# EAGLE design M162B (EAGLE 6.6.0)
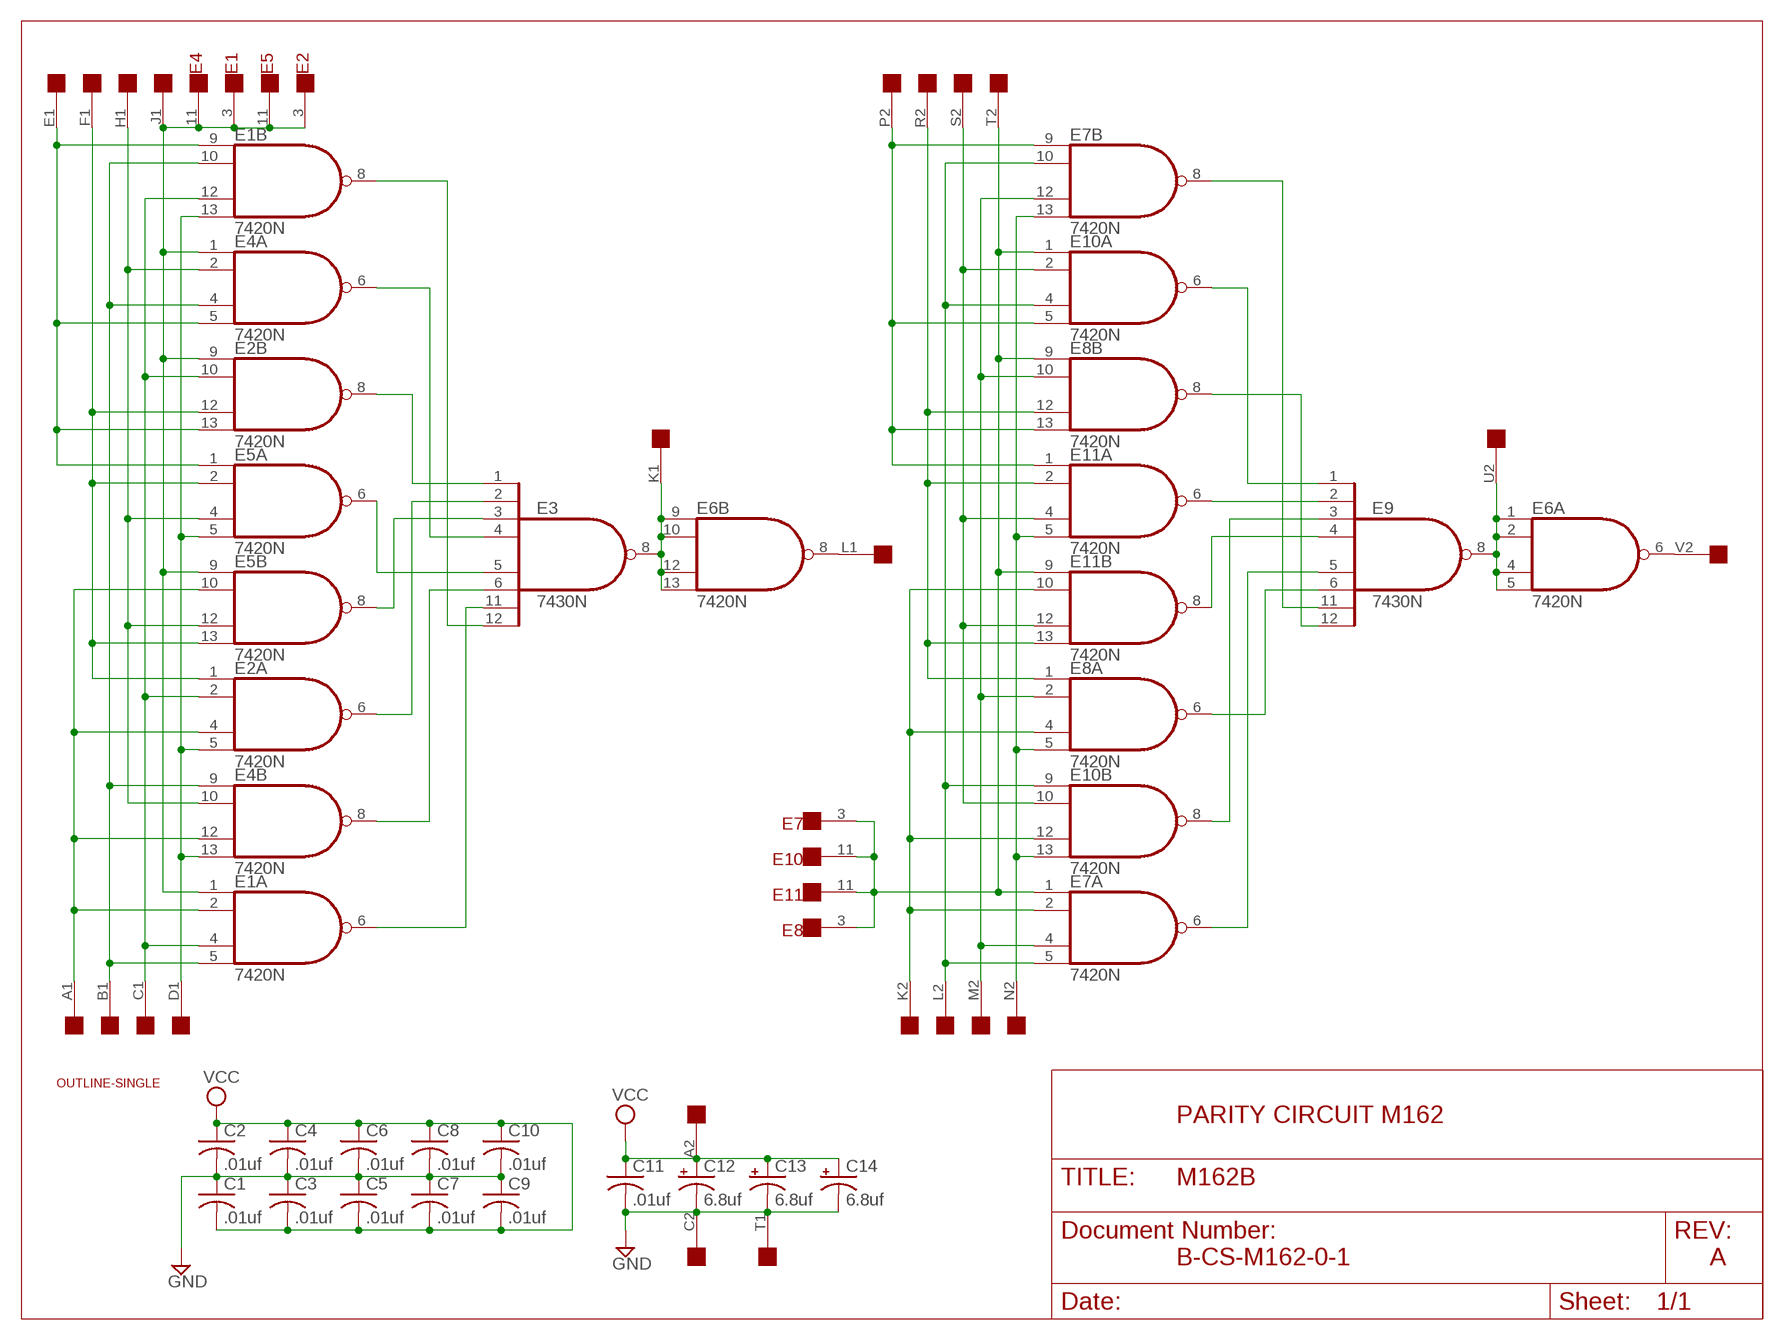
[diagram p0: schematic, sheet 1]

## Parts
C1  .01uf  C-US050-025X075  [C050-025X075]
C2  .01uf  C-US050-025X075  [C050-025X075]
C3  .01uf  C-US050-025X075  [C050-025X075]
C4  .01uf  C-US050-025X075  [C050-025X075]
C5  .01uf  C-US050-025X075  [C050-025X075]
C6  .01uf  C-US050-025X075  [C050-025X075]
C7  .01uf  C-US050-025X075  [C050-025X075]
C8  .01uf  C-US050-025X075  [C050-025X075]
C9  .01uf  C-US050-025X075  [C050-025X075]
C10  .01uf  C-US050-025X075  [C050-025X075]
C11  .01uf  C-US050-025X075  [C050-025X075]
C12  6.8uf  CPOL-USE15-5AXIAL  [E15-5]
C13  6.8uf  CPOL-USE15-5AXIAL  [E15-5]
C14  6.8uf  CPOL-USE15-5AXIAL  [E15-5]
E1  7420N  74S20N  [DIL14]
E2  7420N  74S20N  [DIL14]
E3  7430N  [DIL14]
E4  7420N  74S20N  [DIL14]
E5  7420N  74S20N  [DIL14]
E6  7420N  74S20N  [DIL14]
E7  7420N  74S20N  [DIL14]
E8  7420N  74S20N  [DIL14]
E9  7430N  [DIL14]
E10  7420N  74S20N  [DIL14]
E11  7420N  74S20N  [DIL14]
U$1  OUTLINE-SINGLE  [SINGLE]
U$2  EDGE-2CONNECTOR  [EDGE-CON2]

## Nets
GND [Supply]: C1.1 C2.2 C3.1 C4.2 C5.1 C6.2 C7.1 C8.2 C9.1 C10.2 C11.2 C12.- C13.- C14.- U$2.C2 U$2.T1
N$1: E1.2(A:I1) E2.4(A:I2) E4.12(B:I2) E5.10(B:I1) U$2.A1
N$2: E1.13(B:I3) E2.5(A:I3) E4.13(B:I3) E5.5(A:I3) U$2.D1
N$3: E1.1(A:I0) E1.3(3:NC) E2.3(3:NC) E2.9(B:I0) E4.1(A:I0) E4.11(11:NC) E5.9(B:I0) E5.11(11:NC) U$2.J1
N$4: E4.2(A:I1) E4.10(B:I1) E5.4(A:I2) E5.12(B:I2) U$2.H1
N$5: E1.4(A:I2) E1.12(B:I2) E2.2(A:I1) E2.10(B:I1) U$2.C1
N$6: E1.5(A:I3) E1.10(B:I1) E4.4(A:I2) E4.9(B:I0) U$2.B1
N$7: E2.1(A:I0) E2.12(B:I2) E5.2(A:I1) E5.13(B:I3) U$2.F1
N$8: E1.9(B:I0) E2.13(B:I3) E4.5(A:I3) E5.1(A:I0) U$2.E1
N$9: E1.8(B:O) E3.12(I7)
N$10: E3.4(I3) E4.6(A:O)
N$11: E2.8(B:O) E3.1(I0)
N$12: E3.5(I4) E5.6(A:O)
N$13: E3.3(I2) E5.8(B:O)
N$14: E2.6(A:O) E3.2(I1)
N$15: E1.6(A:O) E3.11(I6)
N$16: E3.6(I5) E4.8(B:O)
N$17: E3.8(O) E6.9(B:I0) E6.10(B:I1) E6.12(B:I2) E6.13(B:I3) U$2.K1
N$18: E7.2(A:I1) E8.4(A:I2) E10.12(B:I2) E11.10(B:I1) U$2.K2
N$19: E7.13(B:I3) E8.5(A:I3) E10.13(B:I3) E11.5(A:I3) U$2.N2
N$20: E7.1(A:I0) E7.3(3:NC) E8.3(3:NC) E8.9(B:I0) E10.1(A:I0) E10.11(11:NC) E11.9(B:I0) E11.11(11:NC) U$2.T2
N$21: E10.2(A:I1) E10.10(B:I1) E11.4(A:I2) E11.12(B:I2) U$2.S2
N$22: E7.4(A:I2) E7.12(B:I2) E8.2(A:I1) E8.10(B:I1) U$2.M2
N$23: E7.5(A:I3) E7.10(B:I1) E10.4(A:I2) E10.9(B:I0) U$2.L2
N$24: E8.1(A:I0) E8.12(B:I2) E11.2(A:I1) E11.13(B:I3) U$2.R2
N$25: E7.9(B:I0) E8.13(B:I3) E10.5(A:I3) E11.1(A:I0) U$2.P2
N$26: E7.8(B:O) E9.11(I6)
N$27: E9.1(I0) E10.6(A:O)
N$28: E8.8(B:O) E9.12(I7)
N$29: E9.2(I1) E11.6(A:O)
N$30: E9.4(I3) E11.8(B:O)
N$31: E8.6(A:O) E9.6(I5)
N$32: E7.6(A:O) E9.5(I4)
N$33: E9.3(I2) E10.8(B:O)
N$34: E6.1(A:I0) E6.2(A:I1) E6.4(A:I2) E6.5(A:I3) E9.8(O) U$2.U2
N$35: E6.6(A:O) U$2.V2
N$36: E6.8(B:O) U$2.L1
VCC [Supply]: C1.2 C2.1 C3.2 C4.1 C5.2 C6.1 C7.2 C8.1 C9.2 C10.1 C11.1 C12.+ C13.+ C14.+ U$2.A2
Unconnected: E1.11(11:NC) E2.11(11:NC) E4.3(3:NC) E5.3(3:NC) E6.3(3:NC) E6.11(11:NC) E7.11(11:NC) E8.11(11:NC) E10.3(3:NC) E11.3(3:NC) U$2.B2 U$2.D2 U$2.E2 U$2.F2 U$2.H2 U$2.J2 U$2.M1 U$2.N1 U$2.P1 U$2.R1 U$2.S1 U$2.U1 U$2.V1

## Notes on the sheet
- PARITY CIRCUIT M162
- B-CS-M162-0-1 | A

## Power pins joined to a net without a drawn wire
GND: E1.7(P:GND) E2.7(P:GND) E3.7(GND) E4.7(P:GND) E5.7(P:GND) E6.7(P:GND) E7.7(P:GND) E8.7(P:GND) E9.7(GND) E10.7(P:GND) E11.7(P:GND)
VCC: E1.14(P:VCC) E2.14(P:VCC) E3.14(VCC) E4.14(P:VCC) E5.14(P:VCC) E6.14(P:VCC) E7.14(P:VCC) E8.14(P:VCC) E9.14(VCC) E10.14(P:VCC) E11.14(P:VCC)

## Library data of the parts
C1-C11 = rcl:C-US: CAPACITOR, American symbol
C12-C14 = rcl:CPOL-US: POLARIZED CAPACITOR, American symbol
E1 E2 E4-E8 E10 E11 = dec-con:74*20: Dual 4-input NAND gate
E3 E9 = 74xx-us:74*30: 8-input NAND gate
U$1 = dec-con:OUTLINE-*: Board outlines for DEC boards.
U$2 = dec-con:EDGE-2: Double-Sided DEC edge connector.

## Net classes
1 Supply: width 0.813 mm

## Board
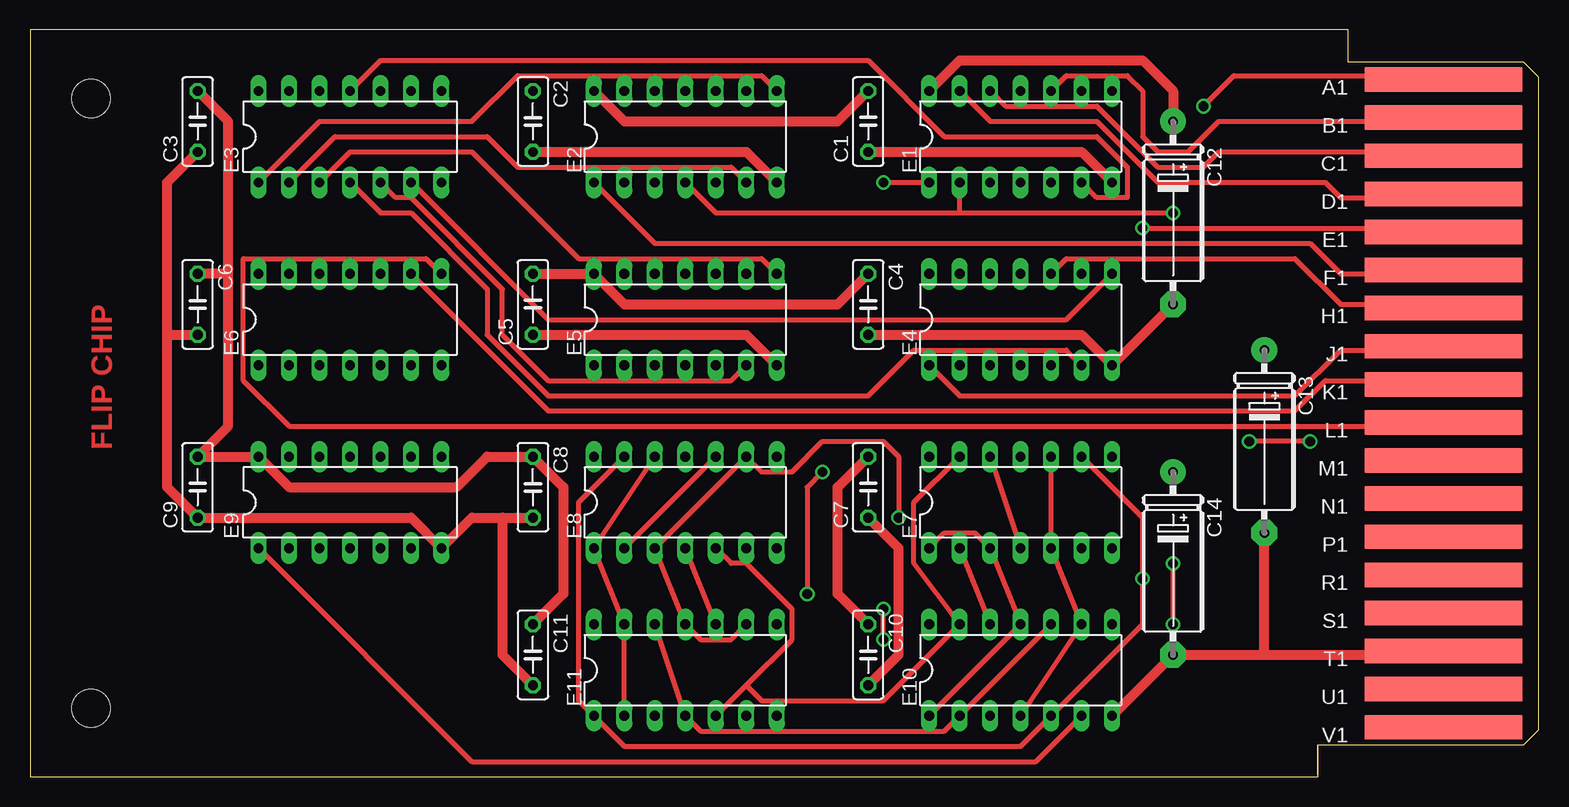
[diagram p1: board, top side]
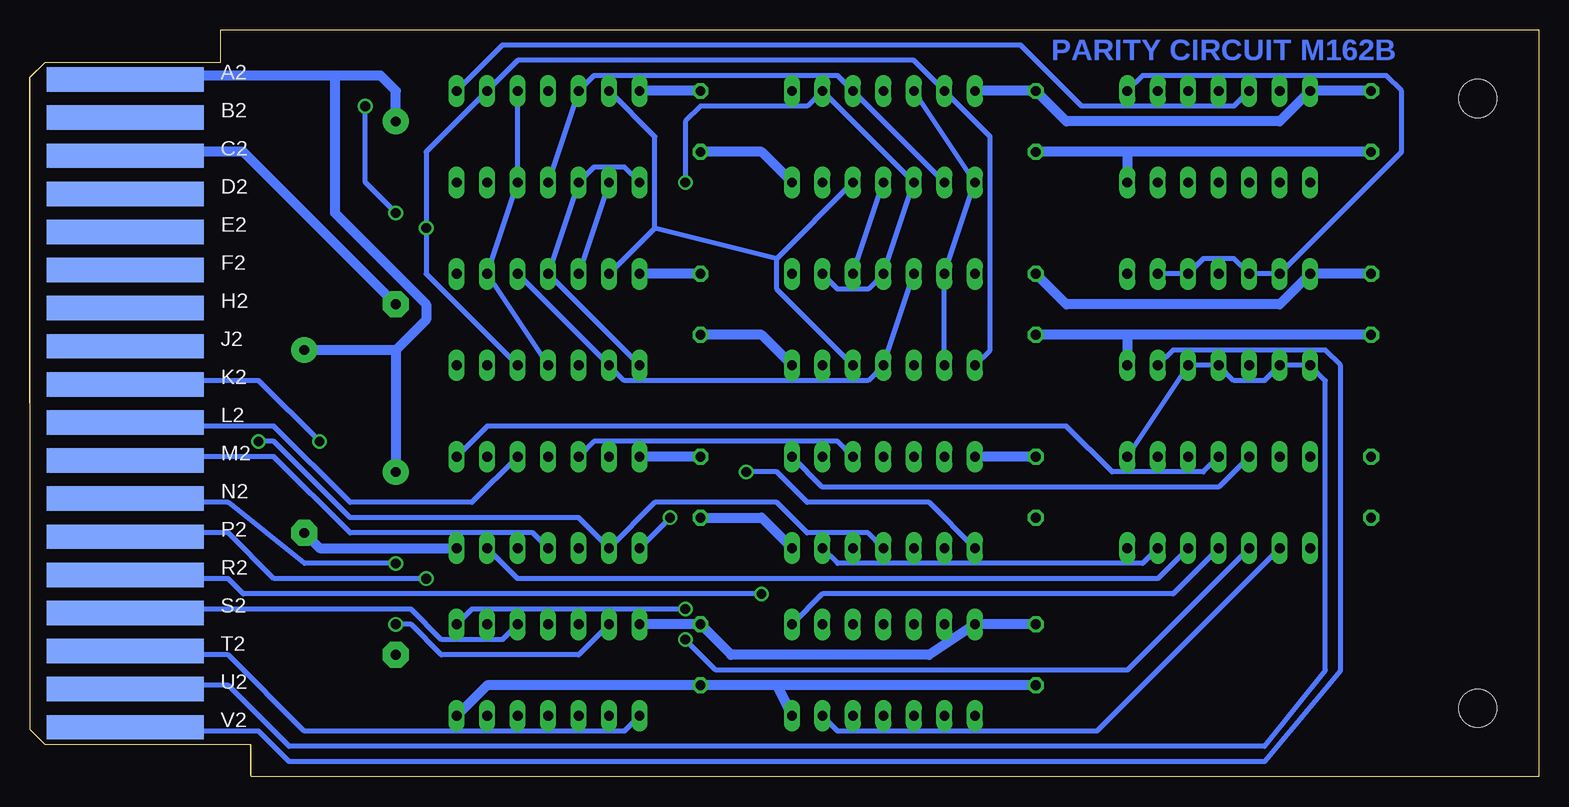
[diagram p2: board, bottom side, seen from below]

Size 125.73 x 62.23 mm. Coordinates in mm from the lower left corner, seen from the top.
Copper layers (1*16): Top 0.035mm / dielectric 1.5mm / Bottom 0.035mm
Design rules "16mils": minimum track width 16mil, minimum drill 32mil, track to track 15mil, track to pad 10mil, pad to pad 10mil, via to via 10mil, smd to smd 10mil, copper to edge 25mil, drill to drill 10mil, minimum pad ring 10mil, minimum via ring 8mil, stop-mask expansion 0mil, vias tented up to drill 0mil, thermal gap 10mil

### Footprints (pad centres in the part's own frame; a part is rotated, then mirrored left to right if it is on the bottom)
C050-025X075 = drill 0.813 octagon: 1 -2.54,0; 2 2.54,0
E15-5 = drill 0.813 pad 2.159: + -7.62,0 | drill 0.813 pad 2.159 octagon: - 7.62,0
DIL14 = drill 0.813 long: 1 -7.62,-3.81; 2 -5.08,-3.81; 3 -2.54,-3.81; 4 0,-3.81; 5 2.54,-3.81; 6 5.08,-3.81; 7 7.62,-3.81; 8 7.62,3.81; 9 5.08,3.81; 10 2.54,3.81; 11 0,3.81; 12 -2.54,3.81; 13 -5.08,3.81; 14 -7.62,3.81
SINGLE = hole 3.175: 120.65,56.515; 120.65,5.715
EDGE-CON2 = smd 13.106 x 2.032: A1 7.938,4.128; B1 7.938,7.303; C1 7.938,10.477; D1 7.938,13.652; E1 7.938,16.828; F1 7.938,20.003; H1 7.938,23.177; J1 7.938,26.352; K1 7.938,29.527; L1 7.938,32.703; M1 7.938,35.877; N1 7.938,39.053; P1 7.938,42.227; R1 7.938,45.403; S1 7.938,48.578; T1 7.938,51.752; U1 7.938,54.928; V1 7.938,58.102 | smd 13.106 x 2.032 bottom: A2 7.938,4.128; B2 7.938,7.303; C2 7.938,10.477; D2 7.938,13.652; E2 7.938,16.828; F2 7.938,20.003; H2 7.938,23.177; J2 7.938,26.352; K2 7.938,29.527; L2 7.938,32.703; M2 7.938,35.877; N2 7.938,39.053; P2 7.938,42.227; R2 7.938,45.403; S2 7.938,48.578; T2 7.938,51.752; U2 7.938,54.928; V2 7.938,58.102

### Placement (x,y rotation side)
C1  69.85,54.61 90 top
C2  41.91,54.61 270 top
C3  13.97,54.61 90 top
C4  69.85,39.37 270 top
C5  41.91,39.37 90 top
C6  13.97,39.37 270 top
C7  69.85,24.13 90 top
C8  41.91,24.13 270 top
C9  13.97,24.13 90 top
C10  69.85,10.16 270 top
C11  41.91,10.16 270 top
C12  95.25,46.99 270 top
C13  102.87,27.94 270 top
C14  95.25,17.78 270 top
E1  82.55,53.34 0 top
E2  54.61,53.34 0 top
E3  26.67,53.34 0 top
E4  82.55,38.1 0 top
E5  54.61,38.1 0 top
E6  26.67,38.1 0 top
E7  82.55,22.86 0 top
E8  54.61,22.86 0 top
E9  26.67,22.86 0 top
E10  82.55,8.89 0 top
E11  54.61,8.89 0 top
U$1  125.73,62.23 180 top
U$2  125.73,62.23 180 top

### Tracks (layer width: path | path; a pad name or v marks a point on that pad's centre or on a via)
GND
  Top 0.813: C4.2 87.63,36.83 E4.7 C12.- | C1.1 87.63,52.07 E1.7 | C2.2 59.69,52.07 E2.7 | C5.1 59.69,36.83 E5.7 | U$2.T1 111.76,10.16 102.87,10.16 | 102.87,10.16 C14.- E10.7 | 102.87,10.16 C13.- | 39.37,21.59 36.83,21.59 E9.7 31.75,21.59 C9.1 11.43,24.13 11.43,36.83 | 39.37,21.59 C8.2 | C11.2 39.37,10.16 39.37,21.59 | 11.43,36.83 11.43,49.53 C3.1 | 11.43,36.83 C6.2 | C10.2 72.39,10.16 72.39,19.05 C7.1
  Bottom 0.813: C11.2 63.5,7.62 | C6.2 34.29,36.83 | 34.29,36.83 E6.7 | 34.29,36.83 C5.1 | C3.1 34.29,52.07 | 34.29,52.07 C2.2 | 34.29,52.07 E3.7 | E5.7 64.77,36.83 C4.2 | C1.1 64.77,52.07 E2.7 | C7.1 64.77,21.59 E8.7 | 63.5,7.62 C10.2 87.63,7.62 E10.7 | 63.5,7.62 E11.7 | E7.7 101.6,19.05 C13.- | U$2.C2 112.09,51.74 111.76,52.07 107.95,52.07 C12.-
N$1  (via drill 0.81)
  Top 0.406: 77.47,46.99 57.15,46.99 E2.4 | 77.47,46.99 E1.2 | 77.47,46.99 v95.25,46.99 | U$2.A1 111.76,58.42 100.33,58.42 v97.79,55.88
  Bottom 0.406: E5.10 E2.4 | E1.2 E4.12 | v97.79,55.88 97.79,49.53 v95.25,46.99
N$2
  Top 0.406: U$2.D1 117.79,48.26 109.22,48.26 107.95,49.53 93.98,49.53 88.9,54.61 80.01,54.61 E1.13
  Bottom 0.406: 63.5,43.18 E2.5 | 63.5,43.18 63.5,40.64 E5.5 | 73.66,45.72 E4.13 | 73.66,45.72 73.66,53.34 E1.13 | 63.5,43.18 73.66,45.72
N$3  (via drill 0.81)
  Top 0.406: U$2.J1 111.76,35.56 109.22,35.56 105.41,31.75 77.47,31.75 E4.1 | v71.12,49.53 E1.1
  Bottom 0.406: v71.12,49.53 71.12,54.61 69.85,55.88 60.96,55.88 E2.9 E2.3 E5.11 55.88,40.64 58.42,40.64 E5.9 | E1.1 76.2,50.8 78.74,50.8 E1.3 E4.11 E4.1
N$4
  Top 0.406: U$2.H1 111.76,39.37 109.22,39.37 105.41,43.18 86.36,43.18 E4.10
  Bottom 0.406: E5.12 E5.4 55.88,33.02 76.2,33.02 E4.2 E4.10
N$5
  Top 0.406: U$2.C1 117.77,52.07 99.06,52.07 97.79,50.8 93.98,50.8 88.9,55.88 81.28,55.88 E1.12
  Bottom 0.406: E2.2 E2.10 58.42,58.42 78.74,58.42 E1.12 E1.4
N$6
  Top 0.406: U$2.B1 111.76,54.61 99.06,54.61 96.52,52.07 93.98,52.07 92.71,53.34 92.71,57.15 91.44,58.42 86.36,58.42 E1.10
  Bottom 0.406: E1.10 E1.5 E4.9 E4.4
N$7
  Top 0.406: U$2.F1 112.04,42.19 111.76,41.91 109.22,41.91 106.68,44.45 52.07,44.45 E2.1
  Bottom 0.406: E2.12 E2.1 E5.13 E5.2
N$8  (via drill 0.81)
  Top 0.406: U$2.E1 111.76,45.72 v92.71,45.72
  Bottom 0.406: E5.1 45.72,35.56 45.72,53.34 E2.13 52.07,59.69 85.09,59.69 E1.9 92.71,52.07 v92.71,45.72 92.71,41.91 E4.5
N$9
  Bottom 0.406: E3.12 25.4,55.88 38.1,55.88 43.18,60.96 86.36,60.96 E1.8
N$10
  Top 0.406: E3.4 29.21,46.99 31.75,46.99 38.1,40.64 38.1,36.83 43.18,31.75 69.85,31.75 73.66,35.56 86.36,35.56 E4.6
N$11
  Top 0.406: E3.1 24.13,54.61 36.83,54.61 40.64,58.42 60.96,58.42 E2.8
N$12
  Top 0.406: E3.5 30.48,48.26 31.75,48.26 39.37,40.64 39.37,36.83 43.18,33.02 58.42,33.02 E5.6
N$13
  Top 0.406: E3.3 26.67,52.07 36.83,52.07 45.72,43.18 60.96,43.18 E5.8
N$14
  Top 0.406: E3.2 25.4,53.34 38.1,53.34 40.64,50.8 58.42,50.8 E2.6
N$15
  Top 0.406: E3.11 29.21,59.69 69.85,59.69 76.2,53.34 88.9,53.34 91.44,50.8 91.44,48.26 88.9,48.26 E1.6
N$16
  Top 0.406: E3.6 43.18,38.1 86.36,38.1 E4.8
N$17
  Top 0.406: U$2.K1 117.78,33.02 107.95,33.02 105.41,30.48 43.18,30.48 E6.9
  Bottom 0.406: E3.8 33.02,58.42 12.7,58.42 11.43,57.15 11.43,52.07 E6.13 E6.12 25.4,43.18 27.94,43.18 E6.10 E6.9
N$18  (via drill 0.81)
  Top 0.406: E11.10 E8.4 | E7.2 E10.12 | v106.68,27.94 v101.6,27.94
  Bottom 0.406: E8.4 55.88,20.32 60.96,20.32 63.5,22.86 73.66,22.86 E7.2 80.01,21.59 99.06,21.59 105.41,27.94 v106.68,27.94 | U$2.K2 112.06,32.72 111.76,33.02 106.68,33.02 v101.6,27.94
N$19  (via drill 0.81)
  Top 0.406: v95.25,12.7 v95.25,17.78 | E7.13 73.66,22.86 73.66,17.78 E10.13 71.12,6.35 60.96,6.35 59.69,7.62 | E8.5 58.42,17.78 59.69,17.78 63.5,13.97 63.5,11.43 59.69,7.62 | E11.5 59.69,7.62
  Bottom 0.406: E10.13 80.01,10.16 91.44,10.16 93.98,12.7 v95.25,12.7 | U$2.N2 111.76,22.86 109.22,22.86 102.87,17.78 v95.25,17.78
N$20  (via drill 0.81)
  Top 0.406: E11.9 58.42,11.43 55.88,11.43 E11.11 E8.3 E8.9 60.96,25.4 63.5,25.4 66.04,27.94 71.12,27.94 72.39,26.67 v72.39,21.59 | E10.1 E10.11 E7.3 78.74,20.32 76.2,20.32 E7.1
  Bottom 0.406: U$2.T2 111.76,10.16 109.22,10.16 102.87,3.81 76.2,3.81 E10.1 | v72.39,21.59 E7.1
N$21
  Top 0.406: E11.12 E11.4 55.88,3.81 76.2,3.81 E10.2 E10.10
  Bottom 0.406: E10.10 86.36,11.43 91.44,11.43 93.98,13.97 111.76,13.97 U$2.S2
N$22
  Top 0.406: E8.2 E8.10 | E7.12 E7.4
  Bottom 0.406: E7.12 78.74,27.94 58.42,27.94 E8.10 | E7.4 83.82,20.32 99.06,20.32 105.41,26.67 111.76,26.67 112.09,26.34 U$2.M2
N$23
  Top 0.406: E7.10 E7.5 E10.9 E10.4
  Bottom 0.406: U$2.L2 112.09,29.54 111.76,29.21 105.41,29.21 99.06,22.86 88.9,22.86 E7.10
N$24  (via drill 0.81)
  Top 0.406: E11.2 E11.13 E8.1 E8.12 | v66.04,25.4 64.77,24.13 v64.77,15.24
  Bottom 0.406: E8.1 50.8,22.86 60.96,22.86 63.5,25.4 v66.04,25.4 | U$2.R2 117.76,16.51 109.22,16.51 107.95,15.24 v64.77,15.24
N$25  (via drill 0.81)
  Top 0.406: E8.13 45.72,22.86 45.72,6.35 E11.1 49.53,2.54 82.55,2.54 E10.5 92.71,12.7 v92.71,16.51 92.71,21.59 E7.9
  Bottom 0.406: U$2.P2 111.76,20.32 109.22,20.32 105.41,16.51 v92.71,16.51
N$26
  Bottom 0.406: E9.11 27.94,25.4 35.56,25.4 39.37,29.21 87.63,29.21 E7.8
N$27
  Top 0.406: E10.6 83.82,1.27 36.83,1.27 E9.1
N$28
  Bottom 0.406: E9.12 26.67,24.13 59.69,24.13 E8.8
N$29
  Bottom 0.406: E9.2 36.83,3.81 58.42,3.81 E11.6
N$30
  Bottom 0.406: E9.4 30.48,15.24 59.69,15.24 E11.8
N$31
  Bottom 0.406: E9.6 33.02,17.78 58.42,17.78 E8.6
N$32
  Bottom 0.406: E9.5 31.75,16.51 85.09,16.51 E7.6
N$33  (via drill 0.81)
  Top 0.406: v71.12,11.43 v71.12,13.97
  Bottom 0.406: E9.3 34.29,8.89 68.58,8.89 v71.12,11.43 | v71.12,13.97 88.9,13.97 E10.8
N$34
  Bottom 0.406: E9.8 E6.5 E6.4 25.4,33.02 22.86,33.02 E6.2 E6.1 17.78,33.02 17.78,8.89 22.86,2.54 104.14,2.54 109.22,7.62 111.76,7.62 U$2.U2
N$35
  Bottom 0.406: U$2.V2 111.76,3.81 106.68,3.81 104.14,1.27 22.86,1.27 16.51,8.89 16.51,34.29 17.78,35.56 30.48,35.56 E6.6
N$36
  Top 0.406: U$2.L1 117.76,29.21 21.59,29.21 17.78,33.02 17.78,43.18 33.02,43.18 E6.8
VCC
  Top 0.813: C5.2 E5.14 49.53,39.37 67.31,39.37 C4.1 | C12.+ 95.25,57.15 92.71,59.69 77.47,59.69 E1.14 | C11.1 44.45,15.24 44.45,24.13 C8.1 38.1,26.67 35.56,24.13 21.59,24.13 E9.14 C9.2 16.51,29.21 16.51,41.91 | C3.2 16.51,54.61 16.51,41.91 | 16.51,41.91 C6.1 | C10.1 67.31,15.24 67.31,24.13 C7.2 | C1.2 67.31,54.61 49.53,54.61 E2.14
  Bottom 0.813: C11.1 E11.14 50.8,10.16 67.31,10.16 C10.1 E10.14 | C3.2 E3.14 21.59,54.61 39.37,54.61 C2.1 E2.14 | C6.1 E6.14 21.59,39.37 39.37,39.37 C5.2 | C7.2 E7.14 | C4.1 E4.14 | C1.2 E1.14 | C8.1 E8.14 | U$2.A2 112.16,58.02 111.76,58.42 100.33,58.42 | 100.33,58.42 96.52,58.42 95.25,57.15 C12.+ | 95.25,35.56 C13.+ | 95.25,35.56 C14.+ | 100.33,58.42 100.33,46.99 92.71,39.37 92.71,38.1 95.25,35.56

### Text on the board
Top: FLIP CHIP
Bottom: PARITY CIRCUIT M162B